# EasyEDA schematic 20250216.json
TITLE: Sheet_1; REV: 1.0; Date: 2025-02-16; Sheet: 1/1; Company: Your Company
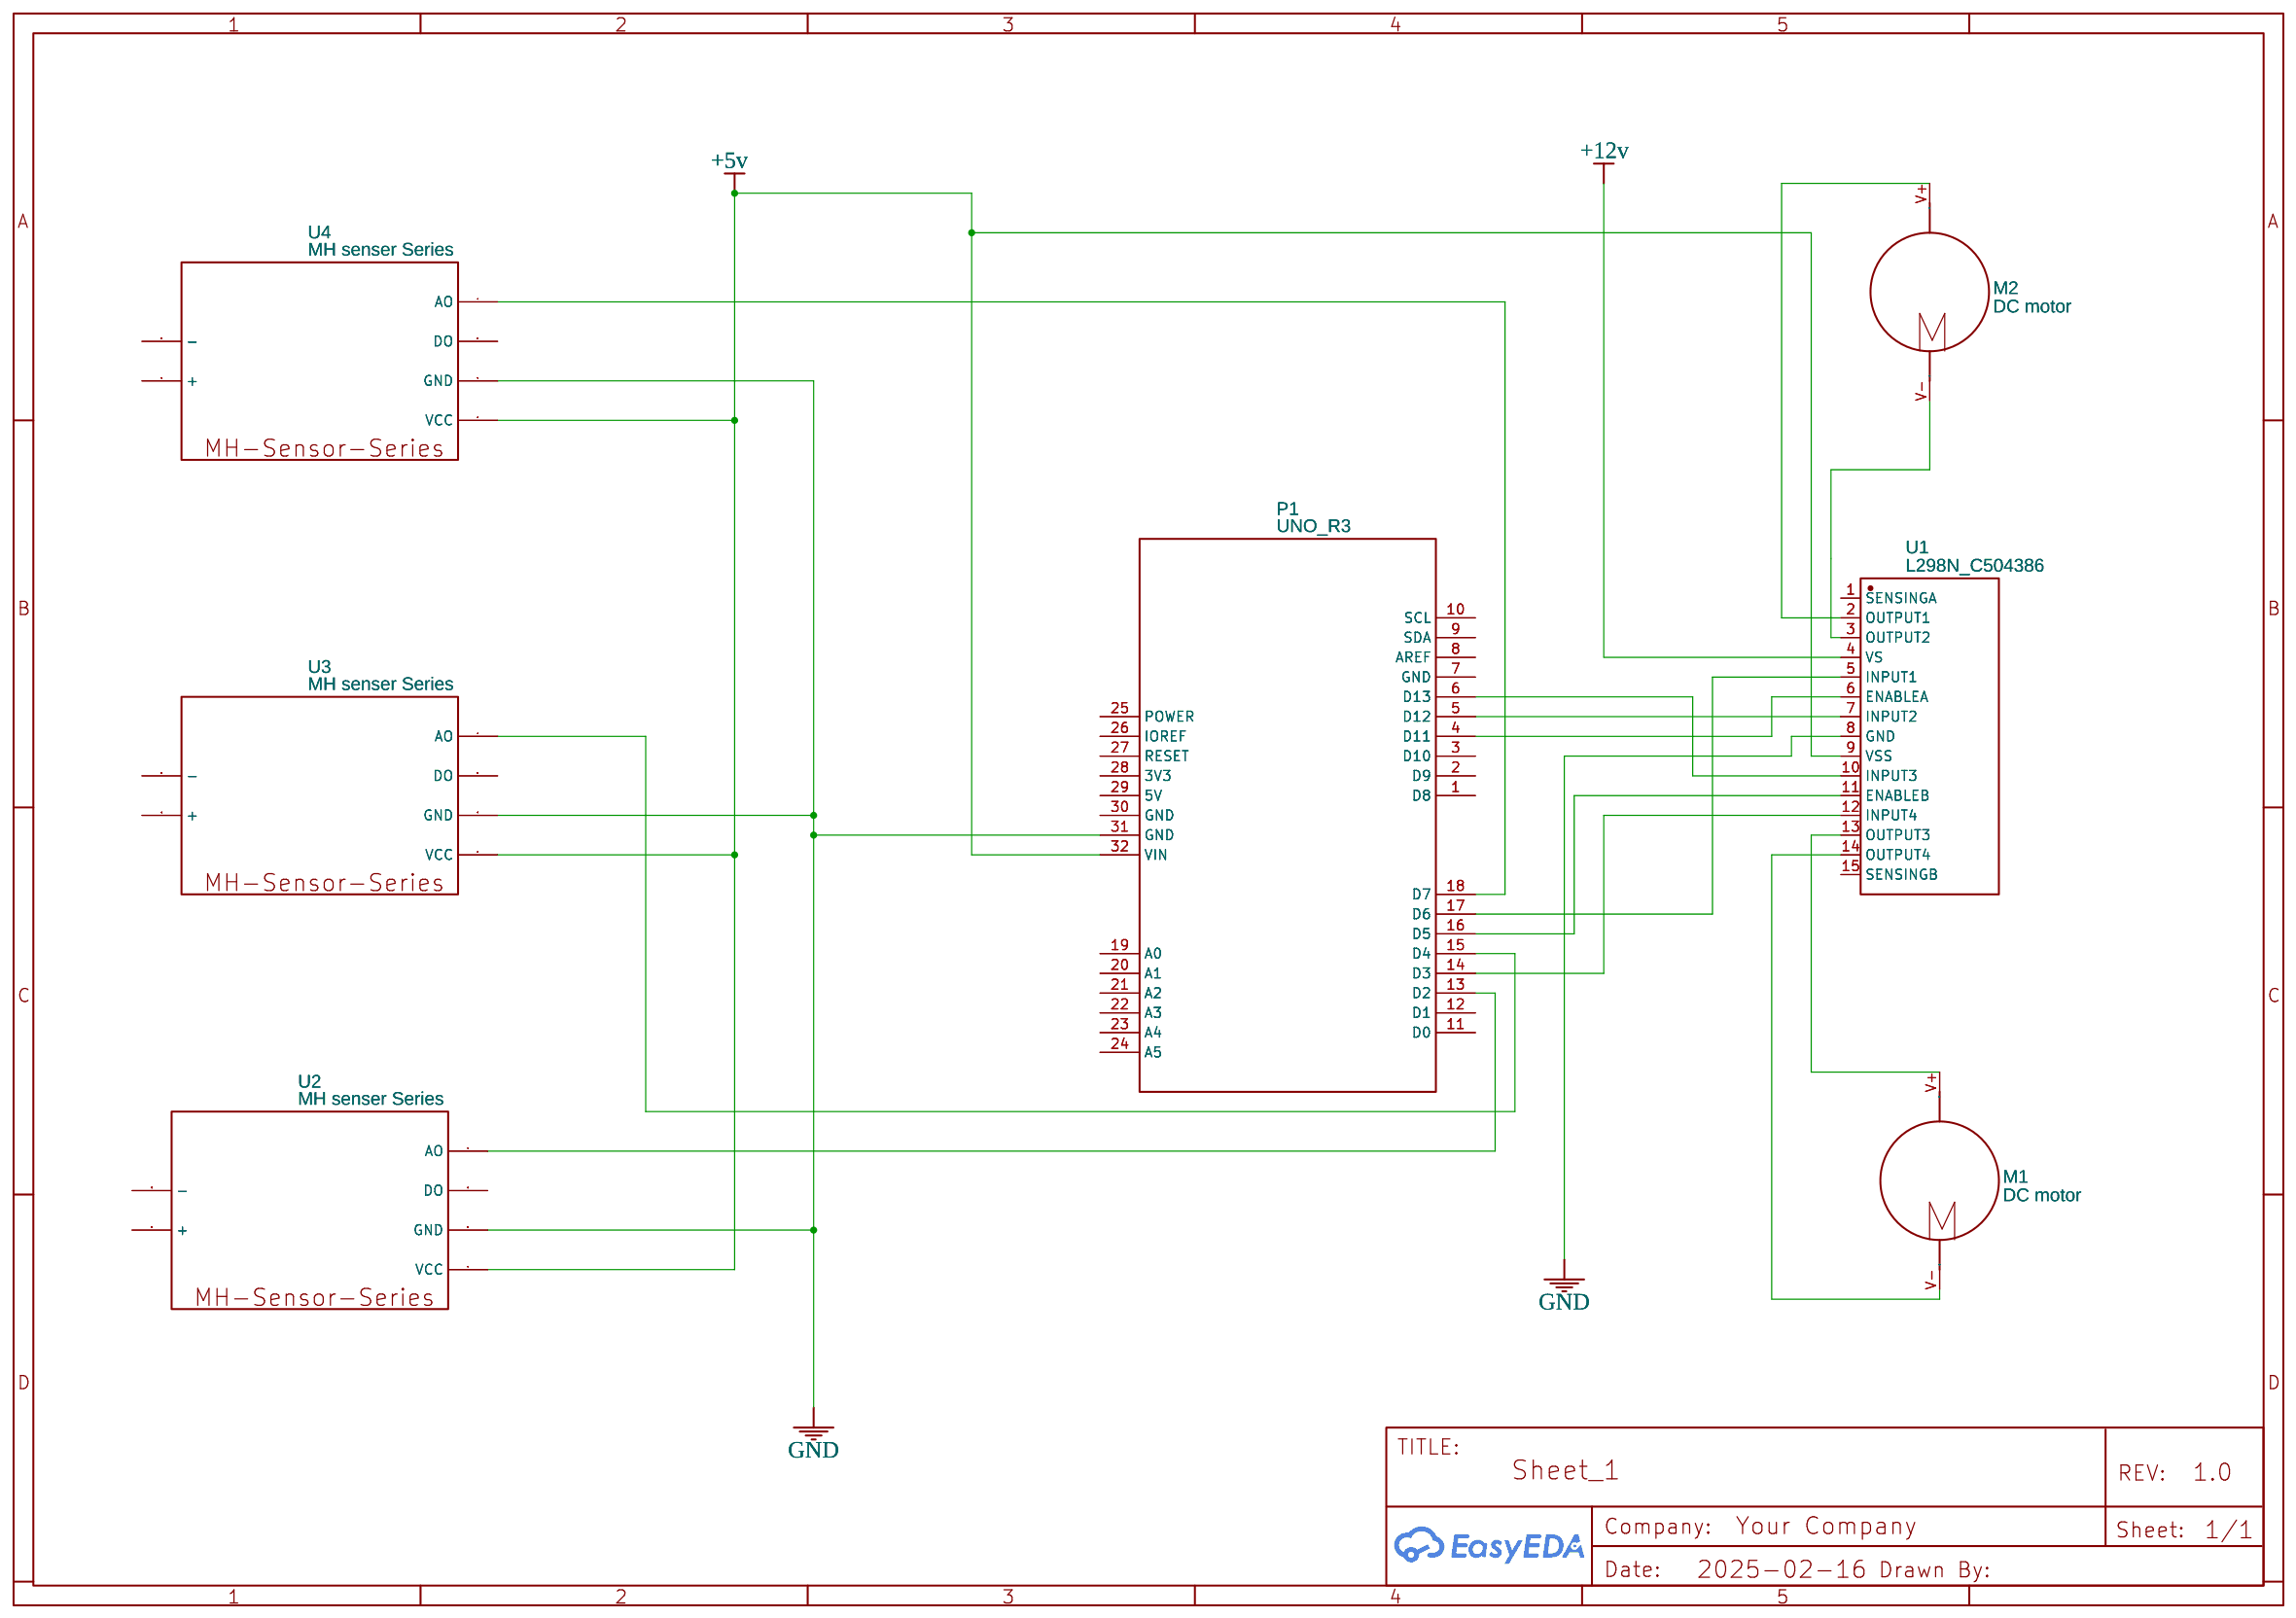
[diagram p0: schematic sheet]

## Parts
M1  DC motor  [DSMOTOR6]
M2  DC motor  [DSMOTOR6]
P1  UNO_R3  [UNO_R3]
U1  L298N_C504386  [MULTIWATT-15_L19.6-W5.0-P1.27-L]
U2  MH senser Series
U3  MH senser Series
U4  MH senser Series

## Library data of the parts
M1 M2 = DC motor: Contributor: tiagoclaro
P1 = UNO_R3: sourceId: 1T5FDZYC8
U1 = L298N_C504386: Contributor: LCSC; Supplier: LCSC; Supplier Part: C504386; Manufacturer: Gcore(上海国芯); Manufacturer Part: L298N; JLCPCB Part Class: Extended Part
U2-U4 = MH senser Series: Contributor: jaouad.arkine

## Nets
+5v: P1.32(VIN) U1.9(VSS) U2.1(VCC) U3.1(VCC) U4.1(VCC)
+12v: U1.4(VS)
GND: P1.31(GND) U1.8(GND) U2.2(GND) U3.2(GND) U4.2(GND)
Net-(M1-V+): M1.V+(V1) U1.13(OUTPUT3)
Net-(M1-V-): M1.V-(V2) U1.14(OUTPUT4)
Net-(M2-V+): M2.V+(V1) U1.2(OUTPUT1)
Net-(M2-V-): M2.V-(V2) U1.3(OUTPUT2)
Net-(P1-4): P1.4(D11) U1.6(ENABLEA)
Net-(P1-5): P1.5(D12) U1.7(INPUT2)
Net-(P1-6): P1.6(D13) U1.10(INPUT3)
Net-(P1-13): P1.13(D2) U2.4(AO)
Net-(P1-14): P1.14(D3) U1.12(INPUT4)
Net-(P1-15): P1.15(D4) U3.4(AO)
Net-(P1-16): P1.16(D5) U1.11(ENABLEB)
Net-(P1-17): P1.17(D6) U1.5(INPUT1)
Net-(P1-18): P1.18(D7) U4.4(AO)

Not connected (* = marked no-connect by the designer): P1 1(D8) 2(D9) 3(D10) 7(GND) 8(AREF) 9(SDA) 10(SCL) 11(D0) 12(D1) 19(A0) 20(A1) 21(A2) 22(A3) 23(A4) 24(A5) 25(POWER) 26(IOREF) 27(RESET) 28(3V3) 29(5V) 30(GND); U1 1(SENSINGA) 15(SENSINGB); U2 3(DO) 5(+) 6(-); U3 3(DO) 5(+) 6(-); U4 3(DO) 5(+) 6(-)
